# Altium schematic sheet PAGE2-Front_PCB.SchDoc
size A3
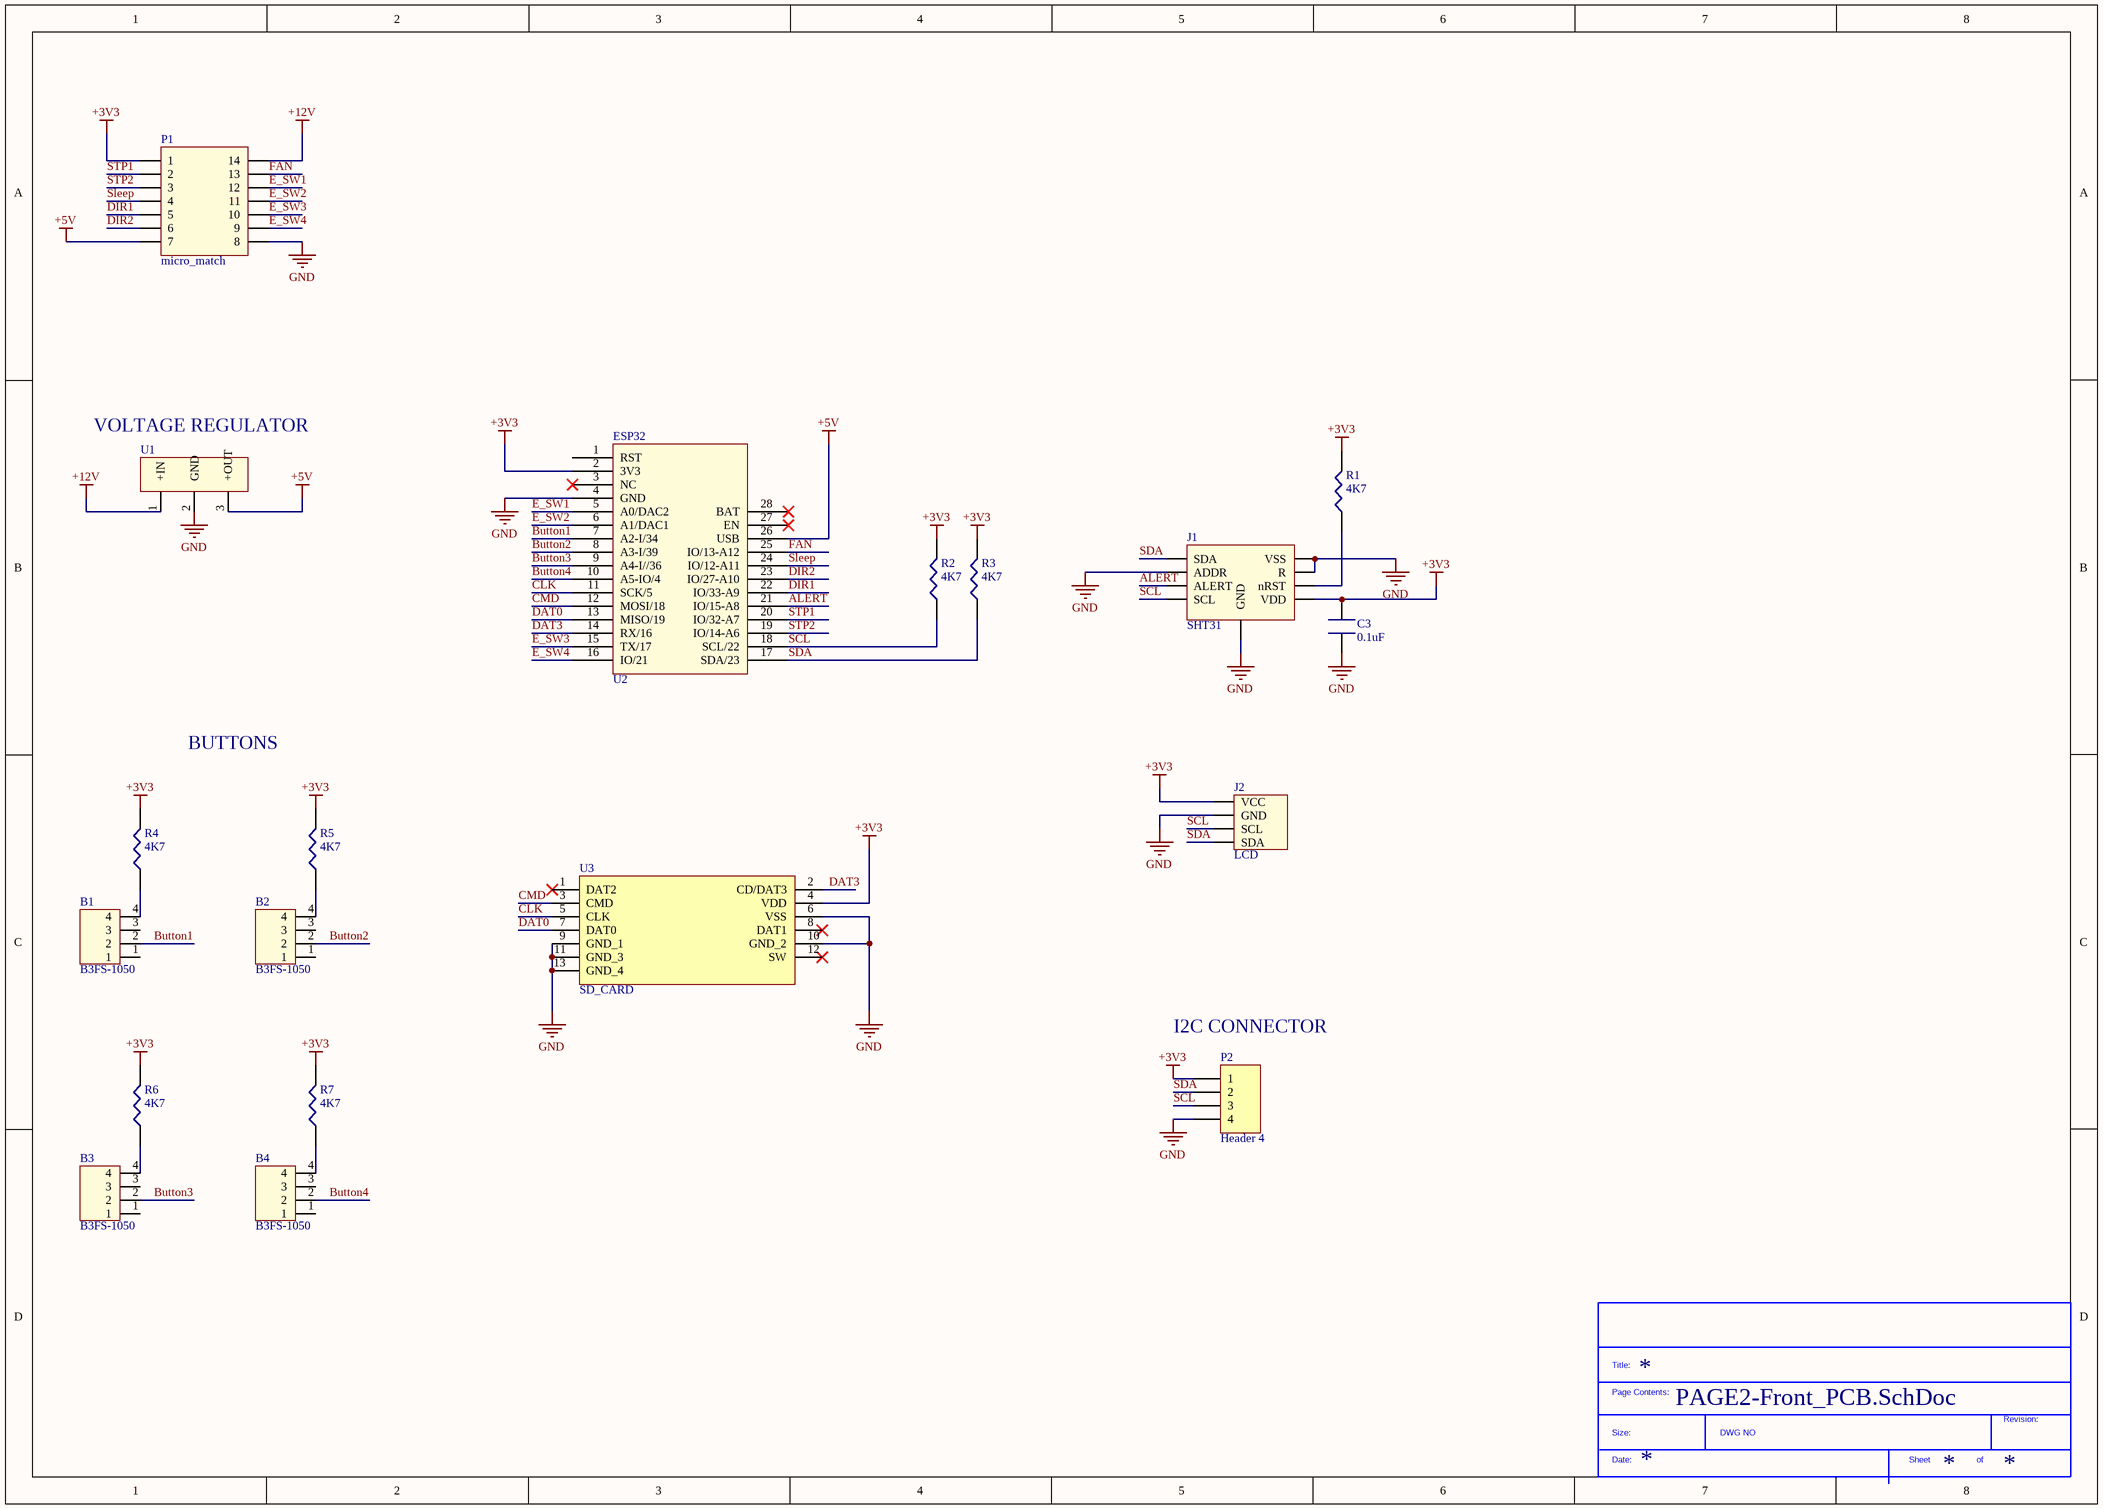
[diagram p0: PAGE2-Front_PCB.SchDoc]

## Parts
*?  SDTitleBlock  (value not drawn)  (graphical)
B1  B3FS-1050  [B3F-1050]
B2  B3FS-1050  [B3F-1050]
B3  B3FS-1050  [B3F-1050]
B4  B3FS-1050  [B3F-1050]
C3  0.1uF  [CAP0603]
J1  SHT31  [SON50P250X100_HS-9N]
J2  LCD  [LCD_DISPLAY]
P1  micro_match  [micro_Match]
P2  Header 4  [HDR1X4]
R1  4K7  [RES0603]
R2  4K7  [RES0603]
R3  4K7  [RES0603]
R4  4K7  [RES0603]
R5  4K7  [RES0603]
R6  4K7  [RES0603]
R7  4K7  [RES0603]
U1  VOLTAGE REGULATOR  [DC-DC]
U2  ESP32  [ESP32]
U3  SD_CARD  [SD_CARD]

## Nets
+3V3: C3.2 J1.5(VDD) J2.1(VCC) P1.1 P2.1 R1.2 R2.2 R3.2 R4.2 R5.2 R6.2 R7.2 U2.2(3V3) U3.4(VDD)
+5V: P1.7 U1.3(+OUT) U2.26(USB)
+12V: P1.14 U1.1(+IN)
GND: C3.1 J1.2(ADDR) J1.7(R) J1.8(VSS) J1.9(GND) J2.2(GND) P1.8 P2.4 U1.2(GND) U2.4(GND) U3.6(VSS) U3.9(GND_1) U3.10(GND_2) U3.11(GND_3) U3.13(GND_4)
ALERT: J1.3(ALERT) U2.21(IO/15-A8)
Button1: B1.2 U2.7(A2-I/34)
Button2: B2.2 U2.8(A3-I/39)
Button3: B3.2 U2.9(A4-I//36)
Button4: B4.2 U2.10(A5-IO/4)
CLK: U2.11(SCK/5) U3.5(CLK)
CMD: U2.12(MOSI/18) U3.3(CMD)
DAT0: U2.13(MISO/19) U3.7(DAT0)
DAT3: U2.14(RX/16) U3.2(CD/DAT3)
DIR1: P1.5 U2.22(IO/33-A9)
DIR2: P1.6 U2.23(IO/27-A10)
E_SW1: P1.12 U2.5(A0/DAC2)
E_SW2: P1.11 U2.6(A1/DAC1)
E_SW3: P1.10 U2.15(TX/17)
E_SW4: P1.9 U2.16(IO/21)
FAN: P1.13 U2.25(IO/13-A12)
SCL: J1.4(SCL) J2.3(SCL) P2.3 R2.1 U2.18(SCL/22)
SDA: J1.1(SDA) J2.4(SDA) P2.2 R3.1 U2.17(SDA/23)
Sleep: P1.4 U2.24(IO/12-A11)
STP1: P1.2 U2.20(IO/32-A7)
STP2: P1.3 U2.19(IO/14-A6)
NetB1_4: B1.4 R4.1
NetB2_4: B2.4 R5.1
NetB3_4: B3.4 R6.1
NetB4_4: B4.4 R7.1
NetJ1_6: J1.6(nRST) R1.1

Not connected (* = marked no-connect by the designer): B1 1 3; B2 1 3; B3 1 3; B4 1 3; U2 1(RST) 3(NC)* 27(EN)* 28(BAT)*; U3 1(DAT2)* 8(DAT1)* 12(SW)*

## Notes on the sheet
- BUTTONS
- (near P2) I2C CONNECTOR
- (in symbol SDTitleBlock) Title:; Page Contents:; Revision:; Size:; DWG NO; Date:; Sheet; of

## Library data of the parts
B1-B4 = B3F-1050: OMRON ELECTRONIC COMPONENTS         B3F-1050             Tactile Switch, Non Illuminated, 24 V, 50 mA, 0.98 N, Solder, B3F Series; Actuator Color: Black; Actuator Length: 4.7 mm; Body Orientation: Straight; Actuator Style: Projected Plunger; Ground Terminal: No; Electrical Life: 1000000 Cycles; Dielectric Strength: 250 VAC; Contact Rating @ Voltage: 0.05@24VDC A; Maximum DC Voltage Rating: 24 V; Pole Throw Configuration: SPST; Illumination Type: N/R; Product Weight: 0.2 g; Maximum Contact Resistance: 100 mOhm; Operating Force: 0.98 N; Switch Configuration: N.O.; Description: SWITCH, SPNO, EXTENDED; Supplier 1: Farnell; Manufacturer: Omron; Manufacturer Part Number: B3FS-1050; Stock 1: 1716; Contact Material: N/A; Base Material: N/A; Family: B3FS; Contact Plating: Silver; Housing Material: N/A; Dimension: 6.3 x 8 x 7.3 mm; Part No: B3FS-1050; RoHS: Yes; Maximum AC Voltage Rating: N/A; Seal Description: N/A; Mechanical Life: N/A; Packaging: Bag; Mounting: Surface Mount,Gull Wing; Minimum Insulation Resistance: 100 MOhm; Operating Temperature: -25 to 70 C; Type: N/A; Seal Location: N/A; ComponentLink1URL: http://www.onlinecomponents.com/productFiles/mf-OM/en-b3fs.pdf; ComponentLink1Description: http://www.onlinecomponents.com/productFiles/mf-OM/en-b3fs.pdf; ComponentLink2URL: http://www.farnell.com/datasheets/1518732.pdf; ComponentLink2Description: http://www.farnell.com/datasheets/1518732.pdf; ComponentLink3URL: http://omronfs.omron.com/en_US/ecb/products/pdf/en-b3fs.pdf; ComponentLink3Description: http://omronfs.omron.com/en_US/ecb/products/pdf/en-b3fs.pdf; Supplier Part Number 1: 3121185; Pricing 1: 5=1.6, 100=1.52, 250=1.44, 1000=1.12, 2500=1.04 (GBP)
C3 = 0.1uF Cap: KEMET         C0603C104K4RAC7081             SMD Multilayer Ceramic Capacitor, 0603 [1608 Metric], 0.1 F, 16 V,  10%, X7R, C Series; Capacitance: 0.1µF; Voltage Rating: 16V; SVHC: No SVHC (15-Jun-2015); Supplier 1: Farnell; Manufacturer: KEMET; Manufacturer Part Number: C0603C104K4RAC7081; Stock 1: 98220; Pricing 1: 10=0.0639, 100=0.0337, 500=0.0247, 2500=0.0209 (EUR); Ceramic Capacitor Case: 0603 [1608 Metric]; Capacitance Tolerance: ± 10%; Dielectric Characteristic: X7R; Product Range: C Series; Packaging: Cut Tape; Operating Temperature Min: -55°C; Operating Temperature Max: 125°C; Automotive Qualification Standard: -; MSL: MSL 1 - Unlimited; ComponentLink1URL: http://www.farnell.com/datasheets/2112158.pdf; ComponentLink1Description: http://www.farnell.com/datasheets/2112158.pdf; ComponentLink2URL: http://www.farnell.com/datasheets/2316283.pdf; ComponentLink2Description: http://www.farnell.com/datasheets/2316283.pdf; ComponentLink3URL: https://api.kemet.com/component-edge/download/datasheet/C0603C104K4RAC7081.pdf; ComponentLink3Description: https://api.kemet.com/component-edge/download/datasheet/C0603C104K4RAC7081.pdf; Supplier Part Number 1: 2522597
J1 = SHT31-DIS-B: SENSIRION         SHT31-DIS-B             Humidity Sensor, 2 %, 3.3 V, 0% to 100% Relative Humidity, TDFN, 8 Pins, 8 s; Sensor Function: Temperature & Humidity; Output Type: Digital; Interface Type: I2C; Accuracy: ±0.3 (Temperature) °C, ±2 (Humidity) %RH; Minimum Operating Supply Voltage: 2.4 V; Maximum Operating Supply Voltage: 5.5 V; Resolution: 0.05 (Humidity) %RH, 0.05 (Temperature) °C; Supplier 1: Farnell; Manufacturer: Sensirion; Manufacturer Part Number: SHT31-DIS-B; Stock 1: 0; Mounting Type: Surface Mount; Pin Count: 8; Minimum Operating Temperature: -40 °C; Maximum Operating Temperature: +125 °C; Package Type: DFN; Length: 2.6mm; Height: 1mm; Width: 2.6mm; Dimensions: 2.6 x 2.6 x 1mm; ComponentLink1URL: http://www.farnell.com/datasheets/1905459.pdf; ComponentLink1Description: http://www.farnell.com/datasheets/1905459.pdf; ComponentLink2URL: http://uk.rs-online.com/webdocs/13dd/0900766b813ddc9f.pdf; ComponentLink2Description: http://uk.rs-online.com/webdocs/13dd/0900766b813ddc9f.pdf; ComponentLink3URL: https://www.sensirion.com/fileadmin/user_upload/customers/sensirion/Dokumente/2_Humidity_Sensors/Sensirion_Humidity_Sensors_Testing_Guide_V1.2.pdf; ComponentLink3Description: https://www.sensirion.com/fileadmin/user_upload/customers/sensirion/Dokumente/2_Humidity_Sensors/Sensirion_Humidity_Sensors_Testing_Guide_V1.2.pdf; ComponentLink4URL: http://www.farnell.com/datasheets/2611771.pdf; ComponentLink4Description: http://www.farnell.com/datasheets/2611771.pdf; ComponentLink5URL: https://www.sensirion.com/file/datasheet_filter-membrane; ComponentLink5Description: https://www.sensirion.com/file/datasheet_filter-membrane; Supplier Part Number 1: 2474218
J2 = LCD_DISPLAY
P1 = 1-2178711-4: AMP FROM TE CONNECTIVITY         1-2178711-4             Wire-To-Board Connector, Micro-MaTch Value-Line Series, 14 Contacts, Receptacle, 1.27 mm; Manufacturer: TE Connectivity AMP; Number of Contacts: 14; Pitch: 1.27mm; Body Orientation: Straight; Supplier 1: Farnell; Manufacturer Part Number: 1-2178711-4; Stock 1: 904; Pricing 1: 1=1.24, 25=1.15, 70=1.06, 200=0.977, 450=0.89 (EUR); Number of Rows: 2; Type: Board to Board; Mounting Type: Surface Mount; Termination Method: Solder; Series: Micro-MaTch; Contact Material: Copper Alloy; Supplier Part Number 1: 2473362
P2 = Header 4: Header, 4-Pin; LatestRevisionDate: 17-Jul-2002; LatestRevisionNote: Re-released for DXP Platform.; Publisher: Altium Limited
R1-R7 = 4K7: Res Thin Film 0603 4.7K Ohm 0.1% 0.1W(1/10W) ±25ppm/C Molded SMD Automotive Punched T/R; Manufacturer: Panasonic; Manufacturer Part Number: ERA-3AEB472V; Resistance: 4.7 kΩ; Temp Coefficient: ±25 ppm/°C; Working Voltage-Nom: 75 V; Overload Voltage - Max: 150 V; No. of Terminations: 2; Supplier 1: Farnell; Stock 1: 4010; Pricing 1: 10=0.191, 100=0.109, 500=0.0637, 2500=0.0489 (EUR); Rated Power: 0.1 W; Tolerance (%): ±0.1 %; Technology: Thin Film; Operating Temp Range: -55 to +155 °C; Case Size: 0603 (1608 Metric); Height - Max: 0.55 mm; ComponentLink1URL: https://datasheet.ciiva.com/11808/0900766b80fe20f7-11808039.pdf; ComponentLink1Description: https://datasheet.ciiva.com/11808/0900766b80fe20f7-11808039.pdf; ComponentLink2URL: https://datasheet.ciiva.com/29183/451124-da-01-en-widerstand-0603-era-29183789.pdf; ComponentLink2Description: https://datasheet.ciiva.com/29183/451124-da-01-en-widerstand-0603-era-29183789.pdf; ComponentLink3URL: https://datasheet.ciiva.com/22743/485442-22743061.pdf; ComponentLink3Description: https://datasheet.ciiva.com/22743/485442-22743061.pdf; ComponentLink4URL: https://datasheet.ciiva.com/46422/485442-46422693.pdf; ComponentLink4Description: https://datasheet.ciiva.com/46422/485442-46422693.pdf; ComponentLink5URL: https://datasheet.ciiva.com/9116/aoa0000ce26-9116681.pdf; ComponentLink5Description: https://datasheet.ciiva.com/9116/aoa0000ce26-9116681.pdf; ComponentLink6URL: https://datasheet.ciiva.com/22781/485442-22781497.pdf; ComponentLink6Description: https://datasheet.ciiva.com/22781/485442-22781497.pdf; ComponentLink7URL: https://datasheet.ciiva.com/9117/aoa0000ce26-9117707.pdf; ComponentLink7Description: https://datasheet.ciiva.com/9117/aoa0000ce26-9117707.pdf; ComponentLink8URL: https://datasheet.ciiva.com/43455/485442-43455227.pdf; ComponentLink8Description: https://datasheet.ciiva.com/43455/485442-43455227.pdf; ComponentLink9URL: https://datasheet.ciiva.com/16772/70068849-16772572.pdf; ComponentLink9Description: https://datasheet.ciiva.com/16772/70068849-16772572.pdf; ComponentLink10URL: https://datasheet.ciiva.com/48425/era-eng-tds-48425470.pdf; ComponentLink10Description: https://datasheet.ciiva.com/48425/era-eng-tds-48425470.pdf; ComponentLink11URL: https://datasheet.ciiva.com/30078/54aoa0000ce26-30078815.pdf; ComponentLink11Description: https://datasheet.ciiva.com/30078/54aoa0000ce26-30078815.pdf; Supplier Part Number 1: 1577615
U1 = OKI-78SR-5/1.5-W36-C: Non-Isolated DC/DC Converters 7.5W 24Vin 5Vout1 1.5A SIP Non-Iso; Manufacturer: Murata; Power (Watts) - Manufacture Series: 8W; Number of Outputs: 1; Voltage - Input (Min): 7V; Voltage - Input (Max): 36V; Voltage - Output 1: 5V; Efficiency: 90.5%; Supplier 1: Farnell; Manufacturer Part Number: OKI-78SR-5/1.5-W36-C; Stock 1: 0; Category: Power Supplies - Board Mount; Family: DC DC Converters; Series: Okami™ OKI-78SR; Packaging: Tube; Type: Linear Regulator Replacement; Voltage - Output 2: -; Voltage - Output 3: -; Current - Output (Max): 1.5A; Voltage - Isolation: -; Applications: ITE (Commercial); Features: SCP; Mounting Type: Through Hole; Package / Case: 3-SIP Module; Size / Dimension: 0.41" L x 0.30" W x 0.65" H (10.4mm x 7.6mm x 16.5mm); Operating Temperature: -40°C ~ 85°C; Power (Watts) - Max: 8W; ComponentLink1URL: https://datasheet.ciiva.com/8006/1790439-8006672.pdf; ComponentLink1Description: https://datasheet.ciiva.com/8006/1790439-8006672.pdf; ComponentLink2URL: https://datasheet.ciiva.com/2374/oki-78sr-2374163.pdf; ComponentLink2Description: https://datasheet.ciiva.com/2374/oki-78sr-2374163.pdf; ComponentLink3URL: https://datasheet.ciiva.com/8220/oki-78sr-8220327.pdf; ComponentLink3Description: https://datasheet.ciiva.com/8220/oki-78sr-8220327.pdf; ComponentLink4URL: https://datasheet.ciiva.com/4646/oki-78sr-56393-4646361.pdf; ComponentLink4Description: https://datasheet.ciiva.com/4646/oki-78sr-56393-4646361.pdf; ComponentLink5URL: https://datasheet.ciiva.com/6917/1790439-6917306.pdf; ComponentLink5Description: https://datasheet.ciiva.com/6917/1790439-6917306.pdf; ComponentLink6URL: https://datasheet.ciiva.com/17327/oki-78sr-17327359.pdf; ComponentLink6Description: https://datasheet.ciiva.com/17327/oki-78sr-17327359.pdf; Supplier Part Number 1: 2102101
U3 = SD_CARD: Manufacturer: Hirose; Manufacturer Part Number: DM3CS-SF; Product Training Modules: DM3 Series microSD Card Sockets; Featured Product: DM3CS Connector; HTML Datasheet: DM3 Series microSD.html; Card Type: Secure Digital - microSD™; Number of Positions: 10 (8 + 2); Connector Type: Connector and Ejector; Insertion, Removal Method: Hinged Lid; Online Catalog: DM3 Series; Other Names: HR1972DKR; Supplier 1: Farnell; Stock 1: 0; Standard Package: 1; Category: Connectors, Interconnects; Family: Memory Connectors - PC Card Sockets; Series: DM3; Packaging: Digi-Reel®; Ejector Side: -; Mounting Type: Surface Mount, Right Angle; Features: Switch; Height Above Board: 0.072" (1.83mm); Mounting Feature: Normal, Standard - Top; Contact Finish: Gold; Contact Finish Thickness: -; ComponentLink1URL: https://datasheet.ciiva.com/683/e60900232-683360.pdf; ComponentLink1Description: https://datasheet.ciiva.com/683/e60900232-683360.pdf; ComponentLink2URL: https://datasheet.ciiva.com/683/e60900232-683361.pdf; ComponentLink2Description: https://datasheet.ciiva.com/683/e60900232-683361.pdf; ComponentLink3URL: https://datasheet.ciiva.com/7651/1465328-7651895.pdf; ComponentLink3Description: https://datasheet.ciiva.com/7651/1465328-7651895.pdf; ComponentLink4URL: https://datasheet.ciiva.com/3122/e60900232-3122536.pdf; ComponentLink4Description: https://datasheet.ciiva.com/3122/e60900232-3122536.pdf; ComponentLink5URL: https://datasheet.ciiva.com/4581/e60900232-38395-4581034.pdf; ComponentLink5Description: https://datasheet.ciiva.com/4581/e60900232-38395-4581034.pdf; ComponentLink6URL: https://datasheet.ciiva.com/16434/e60900232-16434058.pdf; ComponentLink6Description: https://datasheet.ciiva.com/16434/e60900232-16434058.pdf; ComponentLink7URL: https://datasheet.ciiva.com/16655/e60900232-16655644.pdf; ComponentLink7Description: https://datasheet.ciiva.com/16655/e60900232-16655644.pdf; ComponentLink8URL: https://datasheet.ciiva.com/683/e60900232-683359.pdf; ComponentLink8Description: https://datasheet.ciiva.com/683/e60900232-683359.pdf; Supplier Part Number 1: 1764376